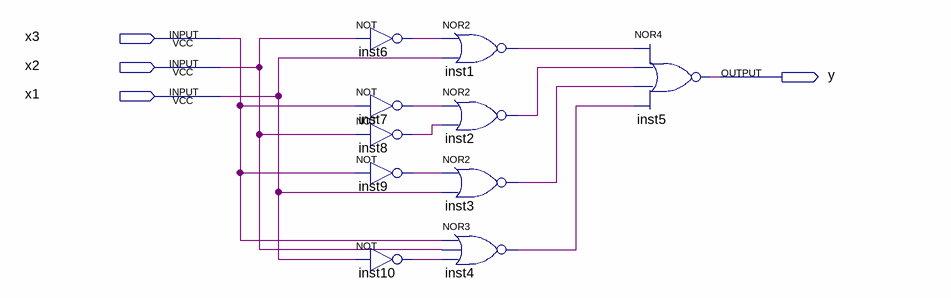
[diagram p0: schematic sheet]
// Quartus schematic LC2.bdf as structural Verilog: 10 symbols, 4 pins
module LC2 (
  input  x3,
  input  x2,
  input  x1,
  output y
);

  wire inst1_out, inst2_out, inst3_out, inst4_out, inst6_out, inst7_out, inst8_out, inst9_out, inst10_out;

  not inst6 (inst6_out, x2);
  not inst7 (inst7_out, x3);
  not inst8 (inst8_out, x2);
  not inst9 (inst9_out, x3);
  not inst10 (inst10_out, x1);
  nor inst1 (inst1_out, inst6_out, x1);
  nor inst2 (inst2_out, inst7_out, inst8_out);
  nor inst3 (inst3_out, inst9_out, x1);
  nor inst4 (inst4_out, x3, x2, inst10_out);
  nor inst5 (y, inst1_out, inst2_out, inst3_out, inst4_out);
endmodule
